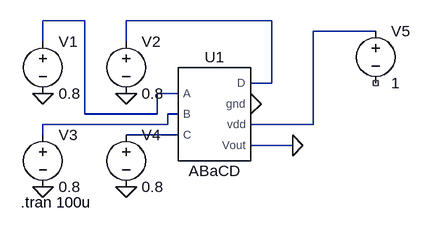
[diagram p0: schematic Draft1.asc]
Draft1.asc, the LTspice schematic file:
Version 4
SHEET 1 880 680
WIRE 0 32 -64 32
WIRE 288 32 64 32
WIRE 448 48 352 48
WIRE -64 64 -64 32
WIRE 64 64 64 32
WIRE 288 128 288 32
WIRE 288 128 256 128
WIRE 144 144 112 144
WIRE 0 176 0 32
WIRE 112 176 112 144
WIRE 112 176 0 176
WIRE 144 176 128 176
WIRE 128 192 128 176
WIRE 128 192 -64 192
WIRE 352 192 352 48
WIRE 352 192 256 192
WIRE -64 208 -64 192
WIRE 144 208 64 208
WIRE 320 224 256 224
FLAG 64 144 0
FLAG -64 144 0
FLAG -64 288 0
FLAG 64 288 0
FLAG 256 160 0
FLAG 320 224 0
SYMBOL ABaCD 192 176 R0
SYMATTR InstName U1
SYMBOL voltage -64 48 R0
WINDOW 123 0 0 Left 2
WINDOW 39 0 0 Left 2
SYMATTR InstName V1
SYMATTR Value 0.8
SYMBOL voltage 64 48 R0
WINDOW 123 0 0 Left 2
WINDOW 39 0 0 Left 2
SYMATTR InstName V2
SYMATTR Value 0.8
SYMBOL voltage -64 192 R0
WINDOW 123 0 0 Left 2
WINDOW 39 0 0 Left 2
SYMATTR InstName V3
SYMATTR Value 0.8
SYMBOL voltage 64 192 R0
WINDOW 123 0 0 Left 2
WINDOW 39 0 0 Left 2
SYMATTR InstName V4
SYMATTR Value 0.8
SYMBOL voltage 448 32 R0
WINDOW 123 0 0 Left 2
WINDOW 39 0 0 Left 2
SYMATTR InstName V5
SYMATTR Value 1
TEXT -98 312 Left 2 !.tran 100u

The netlist it stands for:
* Draft1.asc
XU1 N001 N004 N005 N002 0 N003 0 ABaCD  ; pins A B C D gnd vdd Vout
V1 N001 0 0.8
V2 N002 0 0.8
V3 N004 0 0.8
V4 N005 0 0.8
V5 N003 NC_01 1
.tran 100u
.lib C:\Users\Dell\Desktop\ABaCD.spi
.backanno
.end